# Altium schematic sheet 2_Power.SchDoc
size A4; SheetNumber: 4; SheetTotal: 7
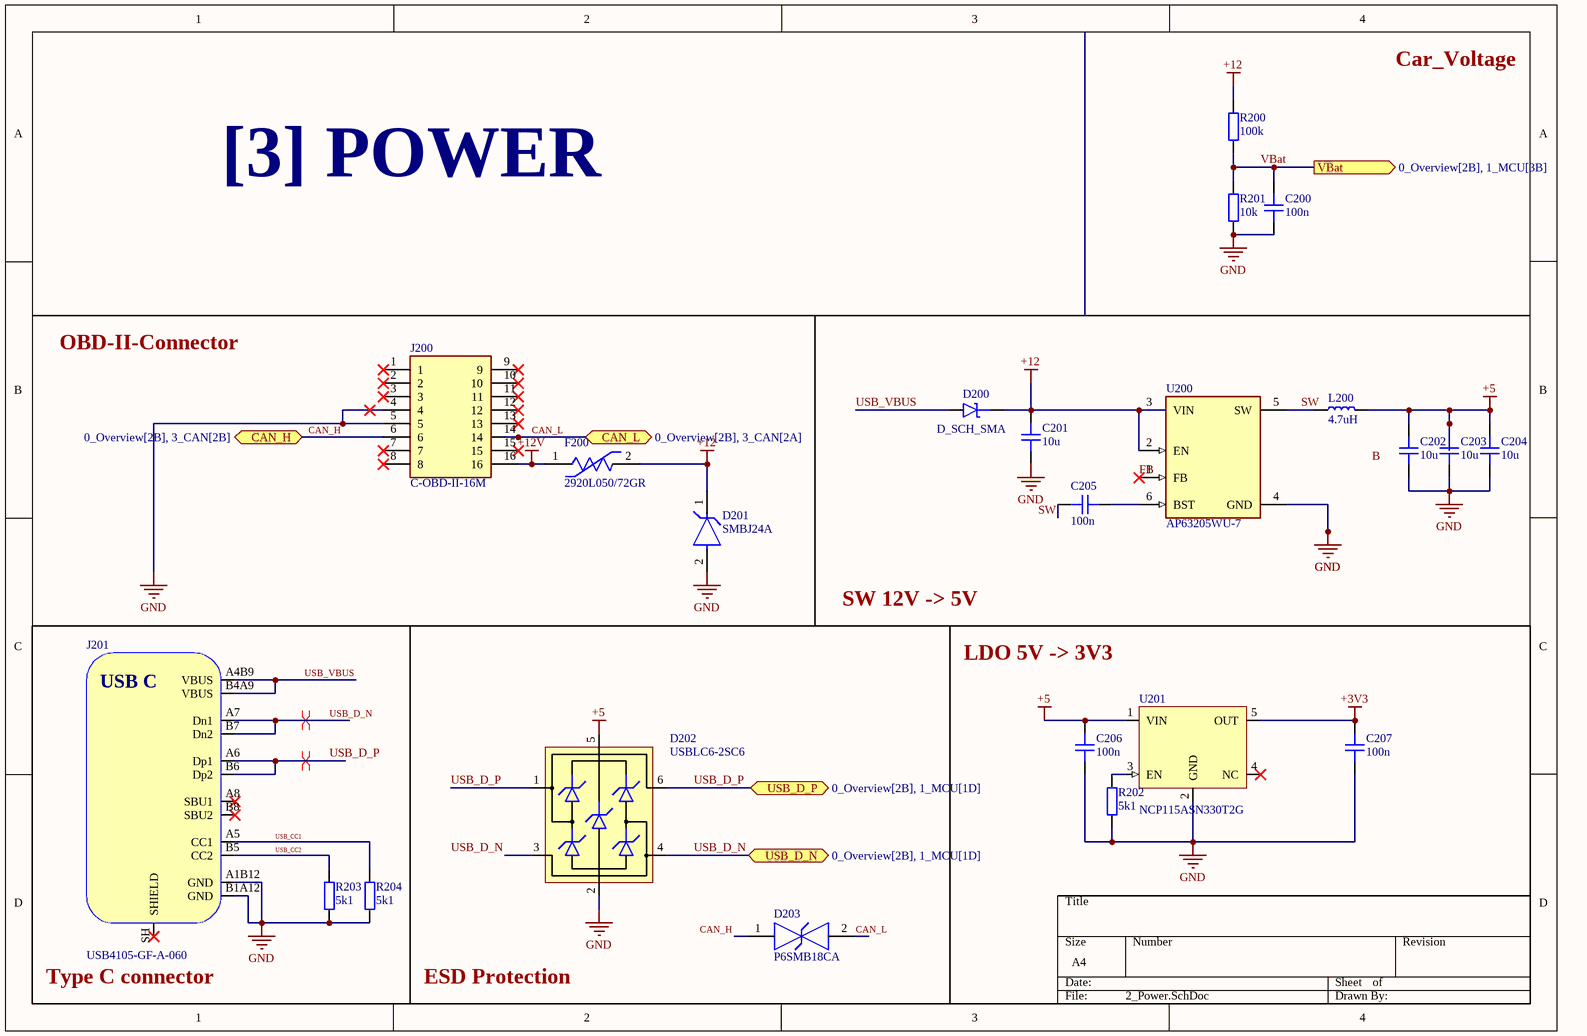
[diagram p0: 2_Power.SchDoc]

## Parts
C200  100n  [CAP_0805]
C201  10u  [CAP_0805]
C202  10u  [CAP_0805]
C203  10u  [CAP_0805]
C204  10u  [CAP_0805]
C205  100n  [CAP_0603]
C206  100n  [CAP_0603]
C207  100n  [CAP_0603]
D200  D_SCH_SMA  [DO-214AC-2 (SMA)]
D201  SMBJ24A  [FP-SMBJ-MFG]
D202  USBLC6-2SC6  [SOT-23-6]
D203  P6SMB18CA  [FP-P6SMB-CA-MFG]
F200  2920L050/72GR  [FP-2920L-MFG]
J200  C-OBD-II-16M  [COMTECH_C-OBD-II-16M]
J201  USB4105-GF-A-060  [USB4105-GF-A-060]
L200  4.7uH  [ASPI-4030S]
R200  100k  [RES_0805]
R201  10k  [RES_0805]
R202  5k1  [RES_0603]
R203  5k1  [RES_0603]
R204  5k1  [RES_0603]
U200  AP63205WU-7  [FP-TSOT26-MFG]
U201  NCP115ASN330T2G  [TSOT25]

## Ports
CAN_H (bidir, see 0_Overview[2B], 3_CAN[2B]), CAN_L (bidir, see 0_Overview[2B], 3_CAN[2A]), USB_D_N (bidir, see 0_Overview[2B], 1_MCU[1D]), USB_D_P (bidir, see 0_Overview[2B], 1_MCU[1D]), VBat (out, see 0_Overview[2B], 1_MCU[3B])

## Nets
+3V3: C207.1 U201.5(OUT)
+5: C202.2 C203.2 C204.2 C206.1 D202.5(VBUS) L200.2 U201.1(VIN)
+12: C201.2 D200.K D201.1(C) F200.2 R200.2 U200.2(EN) U200.3(VIN)
+12V: F200.1 J200.16
GND: C200.1 C201.1 C202.1 C203.1 C204.1 C206.2 C207.2 D201.2(A) D202.2(GND) J200.4 J200.5 J201.A1B12(GND) J201.B1A12(GND) R201.1 R202.1 R203.1 R204.1 U200.4(GND) U201.2(GND)
CAN_H: D203.1 J200.6 ; port CAN_H
CAN_L: D203.2 J200.14 ; port CAN_L
FB: U200.1(FB)
SW: C205.2 L200.1 U200.5(SW)
USB_CC1: J201.A5(CC1) R204.2
USB_CC2: J201.B5(CC2) R203.2
USB_D_N: D202.3(IO2) D202.4(IO2) J201.A7(Dn1) J201.B7(Dn2) ; port USB_D_N
USB_D_P: D202.1(IO1) D202.6(IO1) J201.A6(Dp1) J201.B6(Dp2) ; port USB_D_P
USB_VBUS: D200.A J201.A4B9(VBUS) J201.B4A9(VBUS)
VBat: C200.2 R200.1 R201.2 ; port VBat
NetC205_1: C205.1 U200.6(BST)
NetR202_2: R202.2 U201.3(EN)

Not connected (* = marked no-connect by the designer): J200 1* 2* 3* 7* 8* 9* 10* 11* 12* 13* 15*; J201 A8(SBU1)* B8(SBU2)* SH(SHIELD)*; U201 4(NC)*

## Layout directives
differential pair; differential pair class USB_D: USB_D_N, USB_D_P

## Notes on the sheet
- Car_Voltage
- [3] POWER
- OBD-II-Connector
- SW 12V -> 5V
- LDO 5V -> 3V3
- (near J201) Type C connector
- ESD Protection
- Labels drawn without touching a wire or pin: B
- (in symbol USB4105-GF-A-060) USB C

## Library data of the parts
C200-C204 = CAP_0805: Capacitor SMD 0805; Manufacturer: *; Manufacturer Part Number: *; Distributor Link: *; LCSC: *; Rating: *; Dielectric: *
C205-C207 = CAP_0603: Capacitor SMD 0603; Manufacturer: *; Manufacturer Part Number: *; Distributor Link: *; LCSC: *; Rating: *; Dielectric: *
D200 = D_SCHOTTKY_SMA: Diode Schottky SMD SMA (DO-214AA)
D201 = CMP-07401-000035-1: TVS DIODE 24V 38.9V SMB; Max Breakdown Voltage: 30.7V; Operating Supply Voltage: 3.5V; Min Breakdown Voltage: 26.7V; Test Current: 1mA; Direction: Unidirectional; Peak Pulse Current: 15.4A; Peak Pulse Power: 600W; Number of Unidirectional Channels: 1; Element Configuration: Single; Power Line Protection: No; Diode Type: ZENER; Leakage Current: 5uA; Max Surge Current: 100A; ESD Protection: Yes; Width: 3.94mm; Number of Pins: 2; Clamping Voltage: 38.9V; Reverse Standoff Voltage: 24V; Breakdown Voltage: 30.7V; RoHS Compliant: Yes; Package Quantity: 1; Case/Package: SMB; Mount: Surface Mount; Resistor Type: Zener; Packaging: Tape and Reel; Reverse Breakdown Voltage: 26.7V; Series: SMBJ; Radiation Hardening: No; Max Operating Temperature: 150°C; Termination: SMD/SMT; Number of Channels: 1; Length: 4.57mm; REACH SVHC: No SVHC; Number of Elements: 1; Polarity: Unidirectional; Height: 2.42mm; Max Power Dissipation: 600W; Max Reverse Leakage Current: 5uA; Min Operating Temperature: -55°C
D202 = USBLC6-2SC6: Low-Capacitance ESD Protection USB; Manufacturer: STMicroelectronics; Manufacturer Part Number: USBLC6-2SC6; Distributor Link: https://www.mouser.de/ProductDetail/STMicroelectronics/USBLC6-2SC6?qs=po45yt2pPpu%2FhNIlwQdTlg%3D%3D
D203 = CMP-08607-000095-1: TVS DIODE 15.3V 25.5V DO214AA; Min Breakdown Voltage: 17.1V; Peak Pulse Current: 24.2A; Power Line Protection: No; Max Surge Current: 24A; Polarity: Bidirectional; Power Dissipation: 600W; Number of Bidirectional Channels: 1; Max Breakdown Voltage: 18.9V; Test Current: 1mA; Max Power Dissipation: 5W; Leakage Current: 1uA; Operating Supply Voltage: 15.3V; Min Operating Temperature: -55°C; Mount: Surface Mount; Package Quantity: 3000; Lead Free: Lead Free; Reverse Standoff Voltage: 15.3V; Breakdown Voltage: 17.1V; Composition: Zener; Max Operating Temperature: 150°C; Number of Channels: 1; Termination: SMD/SMT; Case/Package: SMB; Packaging: Tape and Reel; Reverse Breakdown Voltage: 17.1V; Peak Pulse Power: 600W; Number of Elements: 1; Clamping Voltage: 25.5V; Direction: Bidirectional; Number of Pins: 2
F200 = CMP-08606-000028-1: PTC RESET FUSE 60V 1.1A 2920; Manufacturer Part Number: 2920L110/60MR; Manufacturer: Littelfuse; Value: 0.12-0.41Ω; Trip Time: 0.5s; Current Rating: 20A; Trip Current: 2.2A; Category: Fuse; Temperature: -40°C to +85°C; ComponentLink2Description: Datasheet; Lead Free: Yes; Temperature Range Low: -40°C; ComponentLink2URL: https://m.littelfuse.com/~/media/electronics/datasheets/resettable_ptcs/littelfuse_ptc_2920l_datasheet.pdf.pdf; Height: 2mm; Temperature Range High: +85°C; Automotive: No; Digikey Description: PTC RESET FUSE 60V 1.1A 2920; Device Class L3: unset; RoHS: TRUE; Device Class L2: PTC Resettable Fuses; Voltage Rating: 60V; Octopart: https://octopart.com/2920l110%2F60mr-littelfuse-75250824; Device Class L1: Circuit Protection; Package: 2920L; Hold Current: 1.1A; Ambient Temperature Range High: +85°C; Resistance: 0.12-0.41Ω; Ambient Temperature Range Low: -40°C
J200 = CMP-002-00074-1: OBD II 16pin 90 Degree Angle Male Plug Connector; MF: Comtech Electronic Co., LTD; Value: *; Design Item ID: C-OBD-II-16M; Case/Package: None; Check_prices: https://www.snapeda.com/parts/C-OBD-II-16M/Comtech+Electronic+Co.%252C+LTD/view-part/?ref=eda; Component Type: Standard; Source: C-OBD-II-16M.SchLib; Pins: 16; SnapEDA_Link: https://www.snapeda.com/parts/C-OBD-II-16M/Comtech+Electronic+Co.%252C+LTD/view-part/?ref=snap; MP: C-OBD-II-16M
J201 = USB4105-GF-A-060: USB Connector Type C SMT 12 Pin; Manufacturer: GCT; Manufacturer Part Number: USB4105-GF-A-060; Distributor Link: https://eu.mouser.com/ProductDetail/GCT/USB4105-GF-A-060?qs=QNEnbhJQKvY2mocwNJzgfA%3D%3D
L200 = ASPI-4030S: Power Inductor SMD ASPI-4030S Series; Manufacturer: ABRACON; Manufacturer Part Number: ASPI-4030S*; Distirbutor Link: *
R200 R201 = RES_0805: Resistor SMD 0805; Manufacturer: *; Manufacturer Part Number: *; Distributor Link: *; LCSC: *
R202-R204 = RES_0603: Resistor SMD 0603; Manufacturer: *; Manufacturer Part Number: *; Distributor Link: *; LCSC: *
U200 = CMP-12757-000001-1: IC REG BUCK 5V 2A TSOT26; Manufacturer: Diodes Inc.; Max Junction Temp: +160°C; Max Duty Cycle: 100%; Standoff Height: 0.01mm; Max Supply Voltage: 32V; Number Of Outputs: 1; Min Supply Voltage: 3.8V; Output Type: Fixed; Switching Frequency: 1100kHz; Nominal Supply Current: 22uA; Automotive: No; RoHS: TRUE; Switching Topology: Buck; Temperature: -40°C to +85°C; Footprint Url: https://www.diodes.com/assets/Package-Files/TSOT26.pdf; Lead Free: Yes; Digikey Description: IC REG BUCK 5V 2A TSOT26; Device Class L3: Voltage Regulators - Switching; Ambient Temperature Range High: +85°C; Category: IC; Package: TSOT26; Output Voltage: 5V; Output Current: 2A; ComponentLink2Description: Datasheet; Device Class L2: Power Management ICs; Ambient Temperature Range Low: -40°C; Temperature Range High: +85°C; Temperature Range Low: -40°C; Octopart: https://octopart.com/ap63205wu-7-diodes+inc.-98099551; Manufacturer Part Number: AP63205WU-7; Height: 1mm; Device Class L1: Integrated Circuits (ICs); ComponentLink2URL: https://www.diodes.com/assets/Datasheets/AP63200-AP63201-AP63203-AP63205.pdf
U201 = NCP115ASN330T2G: LDO Regulator - High PSRR 300 mA 3.3V TSOP-5; Manufacturer: ON Semiconductor; Manufacturer Part Number: NCP115ASN330T2G